# EAGLE design middleboard (EAGLE 9.3.0)
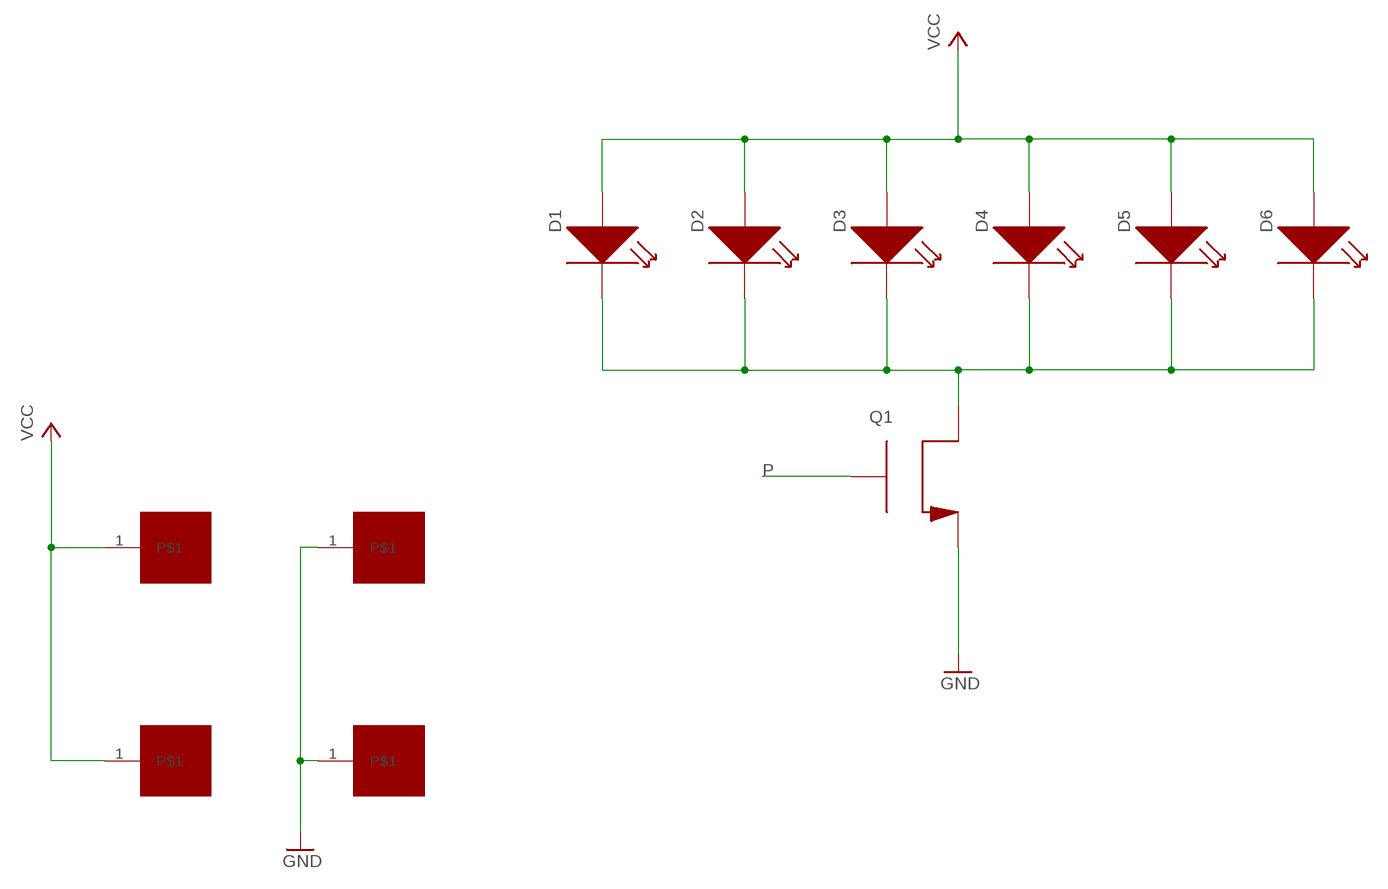
[diagram p0: schematic, sheet 1]

## Parts
D1  NVSLE21AT  [NVSLE21AT]
D2  NVSLE21AT  [NVSLE21AT]
D3  NVSLE21AT  [NVSLE21AT]
D4  NVSLE21AT  [NVSLE21AT]
D5  NVSLE21AT  [NVSLE21AT]
D6  NVSLE21AT  [NVSLE21AT]
P1  PAD  [PAD]
P2  PAD  [PAD]
P3  PAD  [PAD]
P4  PAD  [PAD]
Q1  SIA436DJ  [POWERPAK_SC70-6L]

## Nets
GND: P2.1 P3.1 Q1.P$2(S) Q1.P$3(S)
N$3: D1.P$1(CATHODE) D2.P$1(CATHODE) D3.P$1(CATHODE) D4.P$1(CATHODE) D5.P$1(CATHODE) D6.P$1(CATHODE) Q1.P$1(D) Q1.P$5(D) Q1.P$6(D) Q1.P$7(D) Q1.P$8(D)
P: Q1.P$4(G)
VCC: D1.P$2(ANODE) D2.P$2(ANODE) D3.P$2(ANODE) D4.P$2(ANODE) D5.P$2(ANODE) D6.P$2(ANODE) P1.1 P4.1

## Library data of the parts
D1-D6 = leds:NVSLE21AT
P1-P4 = pad:PAD
Q1 = transistors:SIA436DJ

## Board
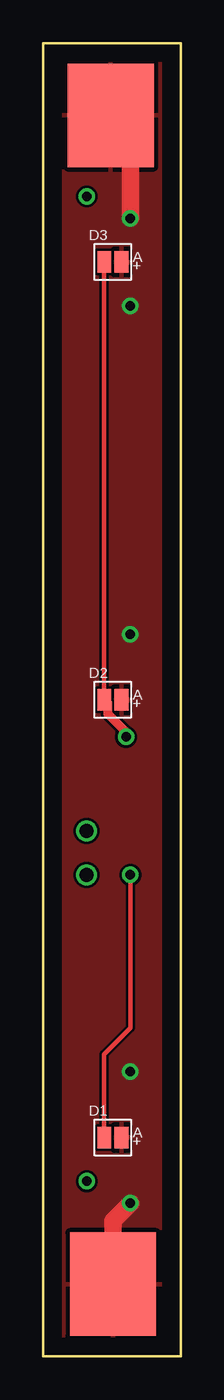
[diagram p1: board, top side]
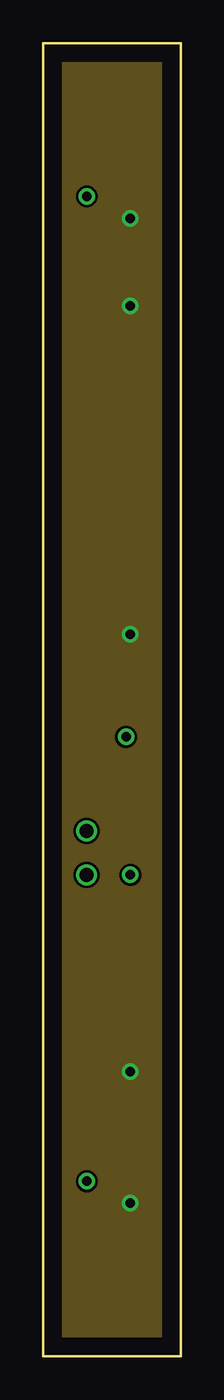
[diagram p2: board, inner layer Route2]
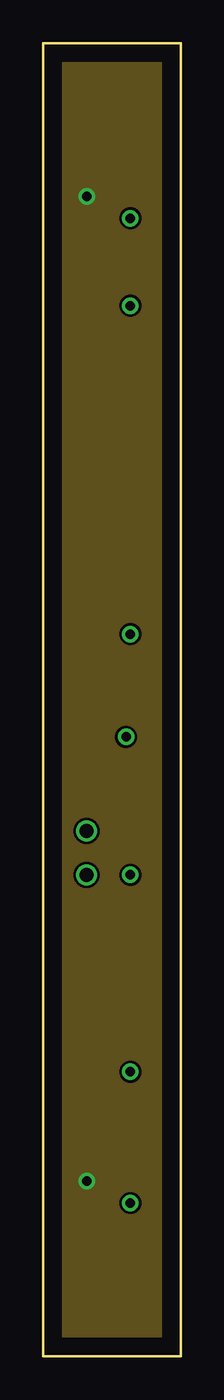
[diagram p3: board, inner layer Route15]
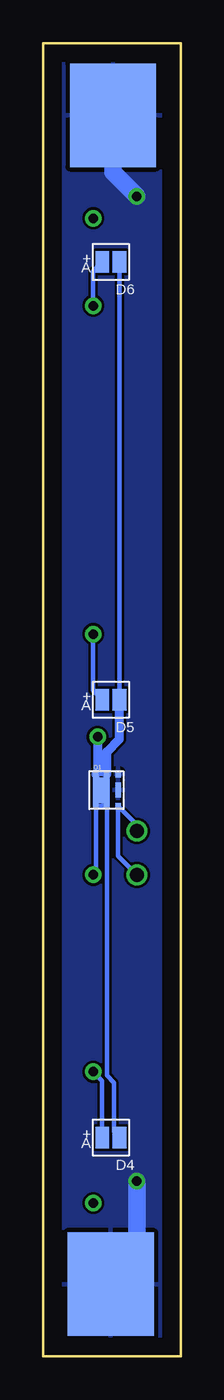
[diagram p4: board, bottom side, seen from below]

Size 8 x 76.2 mm. Coordinates in mm from the lower left corner, seen from the top.
Outline: 0,0 0,76.2 8,76.2 8,0 0,0
Copper layers (1*2*15*16): Top 0.035mm / dielectric 1.5mm / Route2 0.035mm / dielectric 0.15mm / Route15 0.035mm / dielectric 0.2mm / Bottom 0.035mm
Design rules "default *": minimum track width 6mil, minimum drill 0.35mm, track to track 6mil, track to pad 6mil, pad to pad 6mil, via to via 6mil, smd to smd 6mil, copper to edge 40mil, drill to drill 6mil, minimum pad ring 10mil, minimum via ring 8mil, stop-mask expansion 4mil, vias tented up to drill 0mil, thermal gap 10mil

### Footprints (pad centres in the part's own frame; a part is rotated, then mirrored left to right if it is on the bottom)
NVSLE21AT = smd 0.8 x 1.26: P$1 0,0; P$2 1.001,0
PAD = smd 5 x 6: 1 0,0
POWERPAK_SC70-6L = smd 0.94 x 1.499: P$1 0.47,1.105 | smd 0.305 x 0.356: P$2 1.448,2.032; P$4 1.448,0.178; P$5 0.152,2.032; P$6 0.787,2.032; P$7 0.152,0.178; P$8 0.787,0.178 | smd 0.305 x 0.864: P$3 1.448,1.105

### Placement (x,y rotation side)
D1  3.56,12.7 0 top
D2  3.56,38.1 0 top
D3  3.56,63.5 0 top
D4  3.56,12.7 180 bottom
D5  3.56,38.1 180 bottom
D6  3.56,63.5 180 bottom
P1  4.06,4.19 0 top
P2  4.06,4.19 0 bottom
P3  3.94,72.01 0 bottom
P4  3.94,72.01 0 top
Q1  5.08,31.75 0 bottom

### Tracks (layer width: path | path; a pad name or v marks a point on that pad's centre or on a via)
GND  (via drill 0.55)
  Bottom 1.016: v2.54,10.16 2.54,5.71 P2.1 | P3.1 3.94,68.71 v2.54,67.31
  pour Bottom: -1.27,-1.27 -1.27,77.47 8.89,77.47 8.89,-1.27
  pour Route15: -1.27,-1.27 -1.27,77.47 8.89,77.47 8.89,-1.27
N$3  (via drill 0.55)
  Top 0.254: v5.08,27.94 5.08,19.05 3.56,17.53 D4.P$1 | D2.P$1 D3.P$1
  Top 0.508: v4.83,35.94 4.83,36.23 3.75,37.3 3.75,37.91 D2.P$1
  Bottom 0.254: Q1.P$8 Q1.P$7 4.93,28.09 v5.08,27.94 | Q1.P$1 4.61,32.24 Q1.P$8 | Q1.P$1 4.29,33.17 Q1.P$6 Q1.P$5 4.93,33.17 Q1.P$1 | Q1.P$8 4.29,16.3 3.88,15.88 3.88,13.02 D4.P$1 | D3.P$1 D2.P$1
  Bottom 0.508: Q1.P$6 4.29,35.08 3.56,35.81 D2.P$1 | v4.83,35.94 4.83,33.88 Q1.P$5
P  (via drill 0.8)
  Bottom 0.254: v2.54,30.48 2.54,30.84 Q1.P$4 3.63,29.03 v2.54,27.94
VCC  (via drill 0.55)
  Top 1.016: P1.1 4.06,7.87 v5.08,8.89 | v5.08,66.04 5.08,70.87 P4.1
  Bottom 0.254: D3.P$2 5.08,62.98 v5.08,60.96 | D5.P$2 5.08,38.62 v5.08,41.91 | D4.P$2 4.56,15.99 v5.08,16.51
  pour Top: -1.27,-1.27 -1.27,77.47 8.89,77.47 8.89,-1.27
  pour Route2: -1.27,-1.27 -1.27,77.47 8.89,77.47 8.89,-1.27